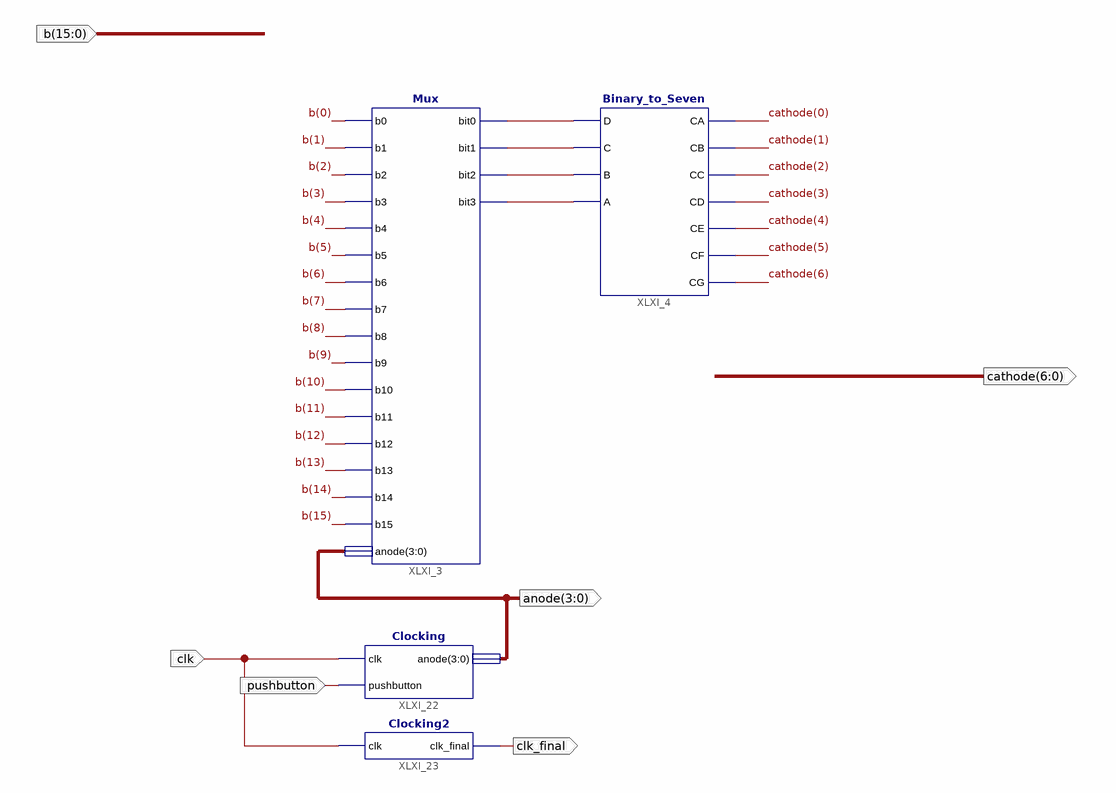
[diagram p0: schematic sheet 1]
// Xilinx ISE schematic lab4_seven_segment_display.sch (artix7) as structural Verilog: 4 symbols, 6 ports
module lab4_seven_segment_display (
  input  [15:0] b,
  input  clk,
  input  pushbutton,
  output [6:0] cathode,
  output [3:0] anode,
  output clk_final
);

  wire XLXN_2, XLXN_3, XLXN_4, XLXN_6;

  Mux XLXI_3 (
    .anode(anode), .b0(b[0]), .b1(b[1]), .b10(b[10]), .b11(b[11]), .b12(b[12]), .b13(b[13]), .b14(b[14]),
    .b15(b[15]), .b2(b[2]), .b3(b[3]), .b4(b[4]), .b5(b[5]), .b6(b[6]), .b7(b[7]), .b8(b[8]), .b9(b[9]),
    .bit0(XLXN_2), .bit1(XLXN_3), .bit2(XLXN_4), .bit3(XLXN_6));
  Binary_to_Seven XLXI_4 (
    .A(XLXN_6), .B(XLXN_4), .C(XLXN_3), .CA(cathode[0]), .CB(cathode[1]), .CC(cathode[2]), .CD(cathode[3]),
    .CE(cathode[4]), .CF(cathode[5]), .CG(cathode[6]), .D(XLXN_2));
  Clocking XLXI_22 (.anode(anode), .clk(clk), .pushbutton(pushbutton));
  Clocking2 XLXI_23 (.clk(clk), .clk_final(clk_final));
endmodule
